# EAGLE design untitled (EAGLE 9.4.2)
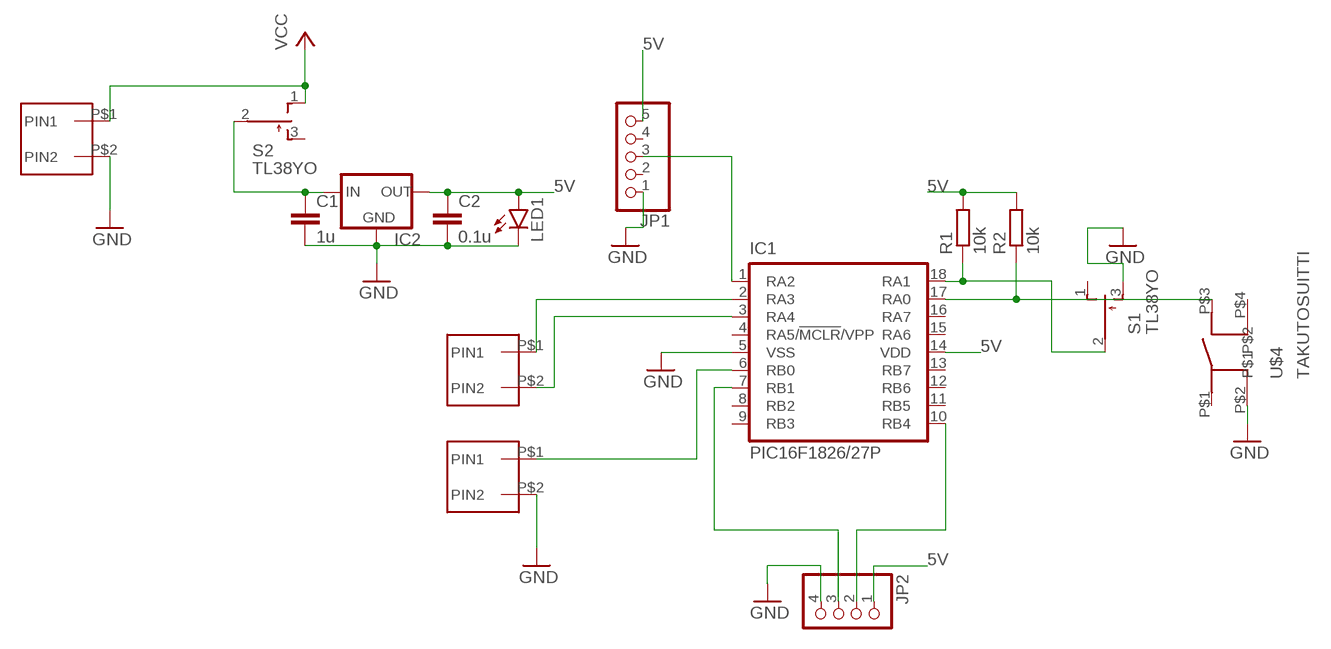
[diagram p0: schematic, sheet 1]

## Parts
C1  1u  C-EU025-025X050  [C025-025X050]
C2  0.1u  C-EU025-025X050  [C025-025X050]
IC1  PIC16F1826/27P  [DIL18]
IC2  78XXS  [78XXS]
JP1  PINHD-1X5  [1X05]
JP2  PINHD-1X4  [1X04]
LED1  LED5MM  [LED5MM]
R1  10k  R-EU_0207/10  [0207/10]
R2  10k  R-EU_0207/10  [0207/10]
S1  TL38YO  [TL3XYO]
S2  TL38YO  [TL3XYO]
U$1  TERMINAL_2  [TERMINAL_2]
U$2  TERMINAL_2  [TERMINAL_2]
U$3  TERMINAL_2  [TERMINAL_2]
U$4  TAKUTOSUITTI  [TAKUTOSUITTI]

## Nets
5V: C2.1 IC1.14(VDD) IC2.OUT JP1.5 JP2.1 LED1.A R1.2 R2.2
GND: C1.2 C2.2 IC1.5(VSS) IC2.GND JP1.1 JP2.4 LED1.K(C) S1.3(S) U$1.P$2(PIN2) U$3.P$2(PIN2) U$4.P$2
N$1: IC1.1(RA2) JP1.3
N$2: IC1.18(RA1) R1.1 S1.2(P)
N$3: U$4.P$4
N$4: C1.1 IC2.IN S2.2(P)
N$5: IC1.10(RB4) JP2.2
N$6: IC1.7(RB1) JP2.3
N$7: IC1.2(RA3) U$2.P$1(PIN1)
N$8: IC1.3(RA4) U$2.P$2(PIN2)
N$9: IC1.6(RB0) U$3.P$1(PIN1)
N$10: IC1.17(RA0) R2.1 U$4.P$3(S)
VCC: S2.1(O) U$1.P$1(PIN1)
Unconnected: IC1.4(RA5/!MCLR!/VPP) IC1.8(RB2) IC1.9(RB3) IC1.11(RB5) IC1.12(RB6) IC1.13(RB7) IC1.15(RA6) IC1.16(RA7) JP1.2 JP1.4 S1.1(O) S2.3(S) U$4.P$1(P)

## Library data of the parts
C1 C2 = rcl:C-EU: CAPACITOR, European symbol; SPICEPREFIX: C
IC1 = microchip:PIC16*F1826/27: 18/20/28-Pin Flash Microcontrollers with nanoWatt XLP Technology Source: www.microchip.com PIC16F1827.pdf
IC2 = v-reg:78XXS: VOLTAGE REGULATOR
JP1 = pinhead:PINHD-1X5: PIN HEADER
JP2 = pinhead:PINHD-1X4: PIN HEADER
LED1 = led:LED: LED OSRAM: - CHIPLED LG R971, LG N971, LY N971, LG Q971, LY Q971, LO R971, LY R971 LH N974, LH R974 LS Q976, LO Q976, LY Q976 LO Q996 - Hyper CHIPLED LW Q18S LB Q993, LB Q99A, LB R99A - SideLED LS A670, LO A670, LY A670, LG A670, LP A670 LB A673, LV A673, LT A673, LW A673 LH A674 LY A675 LS A676, LA A676, LO A676, LY A676, LW A676 LS A679, LY A679, LG A679 - Hyper Micro SIDELED® LS Y876, LA Y876, LO Y876, LY Y876 LT Y87S - SmartLED LW L88C, LW L88S LB L89C, LB L89S, LG L890 LS L89K, LO L89K, LY L89K LS L896, LA L896, LO L896, LY L896 - TOPLED LS T670, LO T670, LY T670, LG T670, LP T670 LSG T670, LSP T670, LSY T670, LOP T670, LYG T670 LG T671, LOG T671, LSG T671 LB T673, LV T673, LT T673, LW T673 LH T674 LS T676, LA T676, LO T676, LY T676, LB T676, LH T676, LSB T676, LW T676 LB T67C, LV T67C, LT T67C, LS T67K, LO T67K, LY T67K, LW E67C LS E67B, LA E67B, LO E67B, LY E67B, LB E67C, LV E67C, LT E67C LW T67C LS T679, LY T679, LG T679 LS T770, LO T770, LY T770, LG T770, LP T770 LB T773, LV T773, LT T773, LW T773 LH T774 LS E675, LA E675, LY E675, LS T675 LS T776, LA T776, LO T776, LY T776, LB T776 LHGB T686 LT T68C, LB T68C - Hyper Mini TOPLED® LB M676 - Mini TOPLED Santana® LG M470 LS M47K, LO M47K, LY M47K Source: http://www.osram.convergy.de LUXEON: - LUMILED® LXK2-PW12-R00, LXK2-PW12-S00, LXK2-PW14-U00, LXK2-PW14-V00 LXK2-PM12-R00, LXK2-PM12-S00, LXK2-PM14-U00 LXK2-PE12-Q00, LXK2-PE12-R00, LXK2-PE12-S00, LXK2-PE14-T00, LXK2-PE14-U00 LXK2-PB12-K00, LXK2-PB12-L00, LXK2-PB12-M00, LXK2-PB14-N00, LXK2-PB14-P00, LXK2-PB14-Q00 LXK2-PR12-L00, LXK2-PR12-M00, LXK2-PR14-Q00, LXK2-PR14-R00 LXK2-PD12-Q00, LXK2-PD12-R00, LXK2-PD12-S00 LXK2-PH12-R00, LXK2-PH12-S00 LXK2-PL12-P00, LXK2-PL12-Q00, LXK2-PL12-R00 Source: www.luxeon.com KINGBRIGHT: KA-3528ASYC Source: www.kingbright.com
R1 R2 = rcl:R-EU_: RESISTOR, European symbol; SPICEPREFIX: R
S1 S2 = switch:TL38YO: TINY SWITCH ON OFF MOM Source: http://www2.produktinfo.conrad.com/datenblaetter/700000-724999/705152-da-01-de-Subminiaturschalter_TL_36YO.pdf
U$1-U$3 = user:TERMINAL_2
U$4 = user_swich:TAKUTOSUITTI

## Board
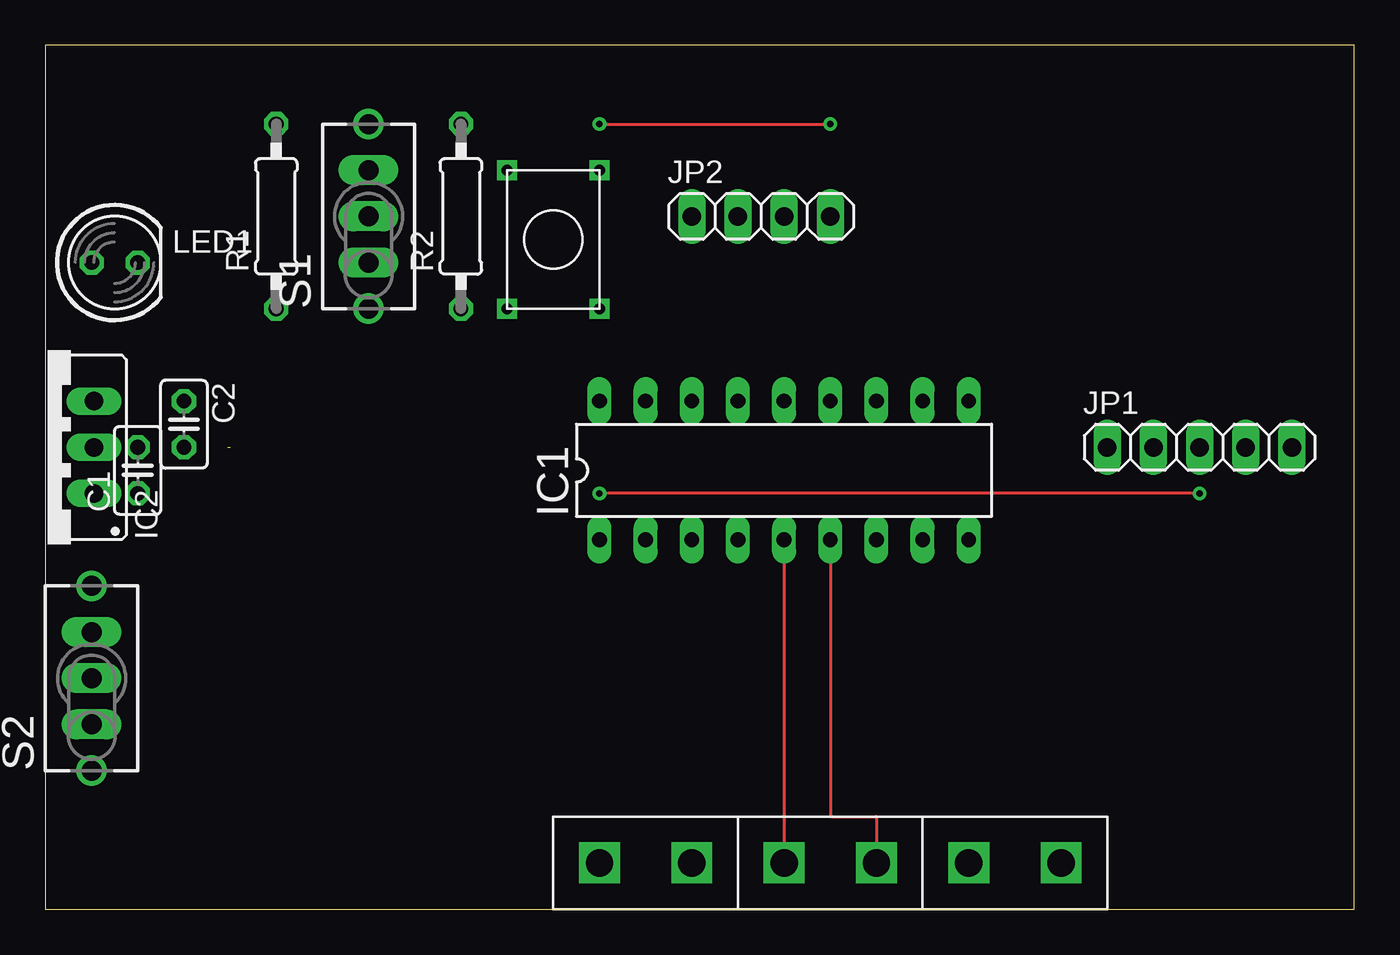
[diagram p1: board, top side]
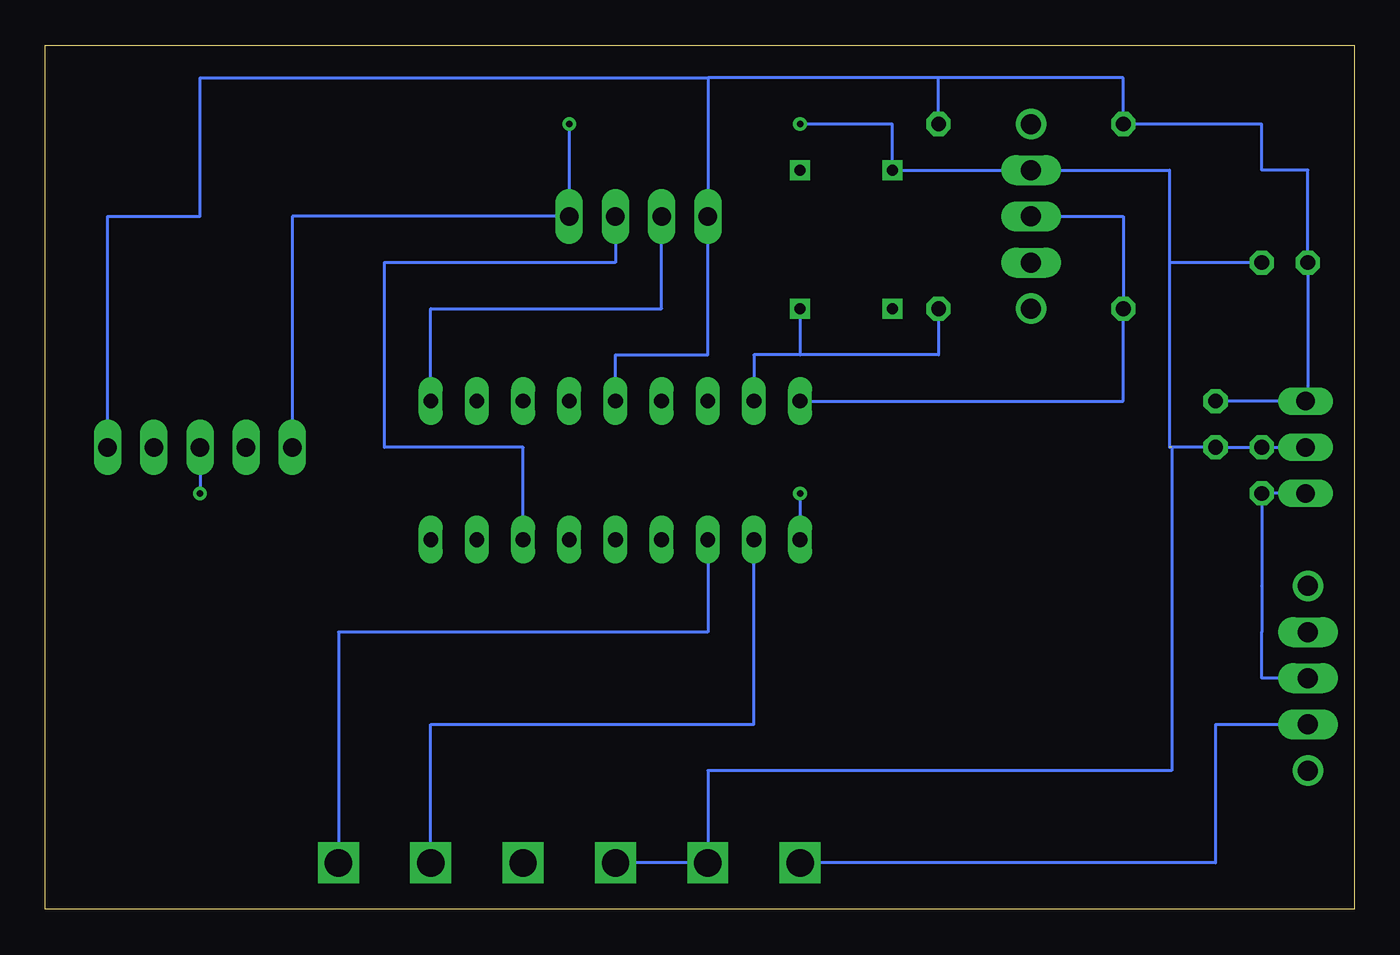
[diagram p2: board, bottom side, seen from below]

Size 72 x 47.5 mm. Coordinates in mm from the lower left corner, seen from the top.
Outline: 0,0 72,0 72,47.5 0,47.5 0,0
Copper layers (1*16): Top 0.035mm / dielectric 1.5mm / Bottom 0.035mm
Design rules "default": minimum track width 6mil, minimum drill 0.35mm, track to track 6mil, track to pad 6mil, pad to pad 6mil, via to via 6mil, smd to smd 6mil, copper to edge 40mil, drill to drill 6mil, minimum pad ring 10mil, minimum via ring 8mil, stop-mask expansion 4mil, vias tented up to drill 0mil, thermal gap 10mil
tKeepout: 18 lines

### Footprints (pad centres in the part's own frame; a part is rotated, then mirrored left to right if it is on the bottom)
C025-025X050 = drill 0.813 octagon: 1 -1.27,0; 2 1.27,0
DIL18 = drill 0.813 long: 1 -10.16,-3.81; 2 -7.62,-3.81; 3 -5.08,-3.81; 4 -2.54,-3.81; 5 0,-3.81; 6 2.54,-3.81; 7 5.08,-3.81; 8 7.62,-3.81; 9 10.16,-3.81; 10 10.16,3.81; 11 7.62,3.81; 12 5.08,3.81; 13 2.54,3.81; 14 0,3.81; 15 -2.54,3.81; 16 -5.08,3.81; 17 -7.62,3.81; 18 -10.16,3.81
78XXS = drill 1.016 long: GND 0,-2.54; IN -2.54,-2.54; OUT 2.54,-2.54
1X05 = drill 1.016 long: 1 -5.08,0; 2 -2.54,0; 3 0,0; 4 2.54,0; 5 5.08,0
1X04 = drill 1.016 long: 1 -3.81,0; 2 -1.27,0; 3 1.27,0; 4 3.81,0
LED5MM = drill 0.813 octagon: A -1.27,0; K 1.27,0
0207/10 = drill 0.813 octagon: 1 -5.08,0; 2 5.08,0
TL3XYO = drill 1.1 pad 1.422 long: 1 -2.54,0; 2 0,0; 3 2.54,0 | drill 1.1 pad 1.676: M1 -5.08,0; M2 5.08,0
TERMINAL_2 = drill 1.5 square: P$1 0,2.54; P$2 0,-2.54
TAKUTOSUITTI = drill 0.6 square: P$1 0,0; P$2 5.08,0; P$3 0,7.62; P$4 5.08,7.62

### Placement (x,y rotation side)
C1  5.08,24.13 90 top
C2  7.62,26.67 270 top
IC1  40.64,24.13 0 top
IC2  0.13,25.4 90 top
JP1  63.5,25.4 0 top
JP2  39.37,38.1 0 top
LED1  3.81,35.56 0 top
R1  12.7,38.1 90 top
R2  22.86,38.1 90 top
S1  17.78,38.1 90 top
S2  2.54,12.7 90 top
U$1  33.02,2.54 90 top
U$2  53.34,2.54 90 top
U$3  43.18,2.54 270 top
U$4  30.48,40.64 180 top

### Tracks (layer width: path | path; a pad name or v marks a point on that pad's centre or on a via)
5V
  Bottom 0.152: 12.57,43.05 R1.2 | 35.56,45.72 JP2.1 35.56,30.48 40.64,30.48 IC1.14 | C2.1 IC2.OUT 2.54,28.07 LED1.A 2.54,40.64 5.08,40.64 5.08,43.18 R1.2 | R1.2 12.7,45.72 22.86,45.72 | R2.2 22.86,45.72 | 22.86,45.72 35.56,45.72 | JP1.5 68.58,38.1 63.5,38.1 63.5,45.72 35.56,45.72
GND  (via drill 0.35)  (1 unrouted)
  Top 0.152: IC1.5 U$3.P$2 | v30.48,43.18 v43.18,43.18
  Bottom 0.152: JP1.1 58.42,38.1 JP2.4 v43.18,43.18 | U$3.P$2 U$1.P$2 35.56,7.62 10.03,7.62 10.03,25.4 | IC2.GND C1.2 C2.2 10.16,25.4 10.16,35.56 | LED1.K 10.16,35.56 | v30.48,43.18 25.4,43.18 U$4.P$2 S1.3 10.16,40.64 10.16,35.56
N$1  (via drill 0.35)
  Top 0.152: v63.5,22.86 v30.48,22.86
  Bottom 0.152: JP1.3 v63.5,22.86 | v30.48,22.86 IC1.1
N$2
  Bottom 0.152: IC1.18 12.7,27.94 R1.1 12.7,38.1 S1.2
N$4
  Bottom 0.152: IC2.IN C1.1 5.08,17.78 5.08,15.24 5.08,12.7 S2.2
N$5
  Bottom 0.152: IC1.10 50.8,33.02 38.1,33.02 JP2.2
N$6
  Bottom 0.152: IC1.7 45.72,25.4 53.34,25.4 53.34,35.56 40.64,35.56 JP2.3
N$7
  Bottom 0.152: IC1.2 33.02,10.16 50.8,10.16 U$2.P$1
N$8
  Bottom 0.152: IC1.3 35.56,15.24 55.88,15.24 U$2.P$2
N$9
  Top 0.152: IC1.6 43.18,5.08 45.72,5.08 U$3.P$1
N$10
  Bottom 0.152: U$4.P$3 30.48,30.48 | IC1.17 33.02,30.48 30.48,30.48 | R2.1 22.86,30.48 30.48,30.48
VCC
  Bottom 0.152: U$1.P$1 7.62,2.54 7.62,10.16 S2.1